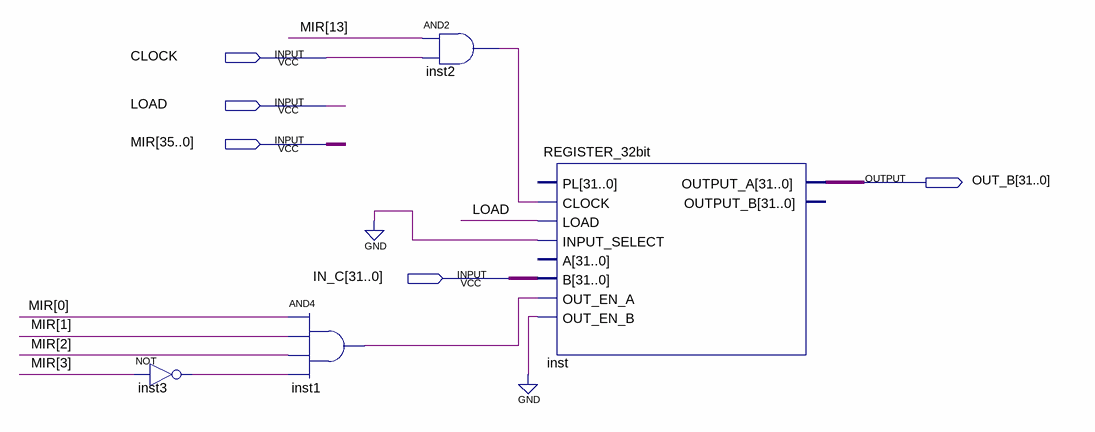
[diagram p0: schematic sheet]
// Quartus schematic TOS.bdf as structural Verilog: 4 symbols, 5 pins
module TOS (
  input  CLOCK,
  input  LOAD,
  input  [35:0] MIR,
  input  [31:0] IN_C,
  output [31:0] OUT_B
);

  wire inst1_out, inst2_out, inst3_out;

  not inst3 (inst3_out, MIR[3]);
  and inst1 (inst1_out, MIR[0], MIR[1], MIR[2], inst3_out);
  and inst2 (inst2_out, MIR[13], CLOCK);
  REGISTER_32bit inst (
    .CLOCK(inst2_out), .LOAD(LOAD), .INPUT_SELECT(1'b0), .B(IN_C), .OUT_EN_A(inst1_out), .OUT_EN_B(1'b0),
    .OUTPUT_A(OUT_B));  // open: PL, A, OUTPUT_B
endmodule
